# Altium schematic sheet Sheet2.SchDoc
size A4
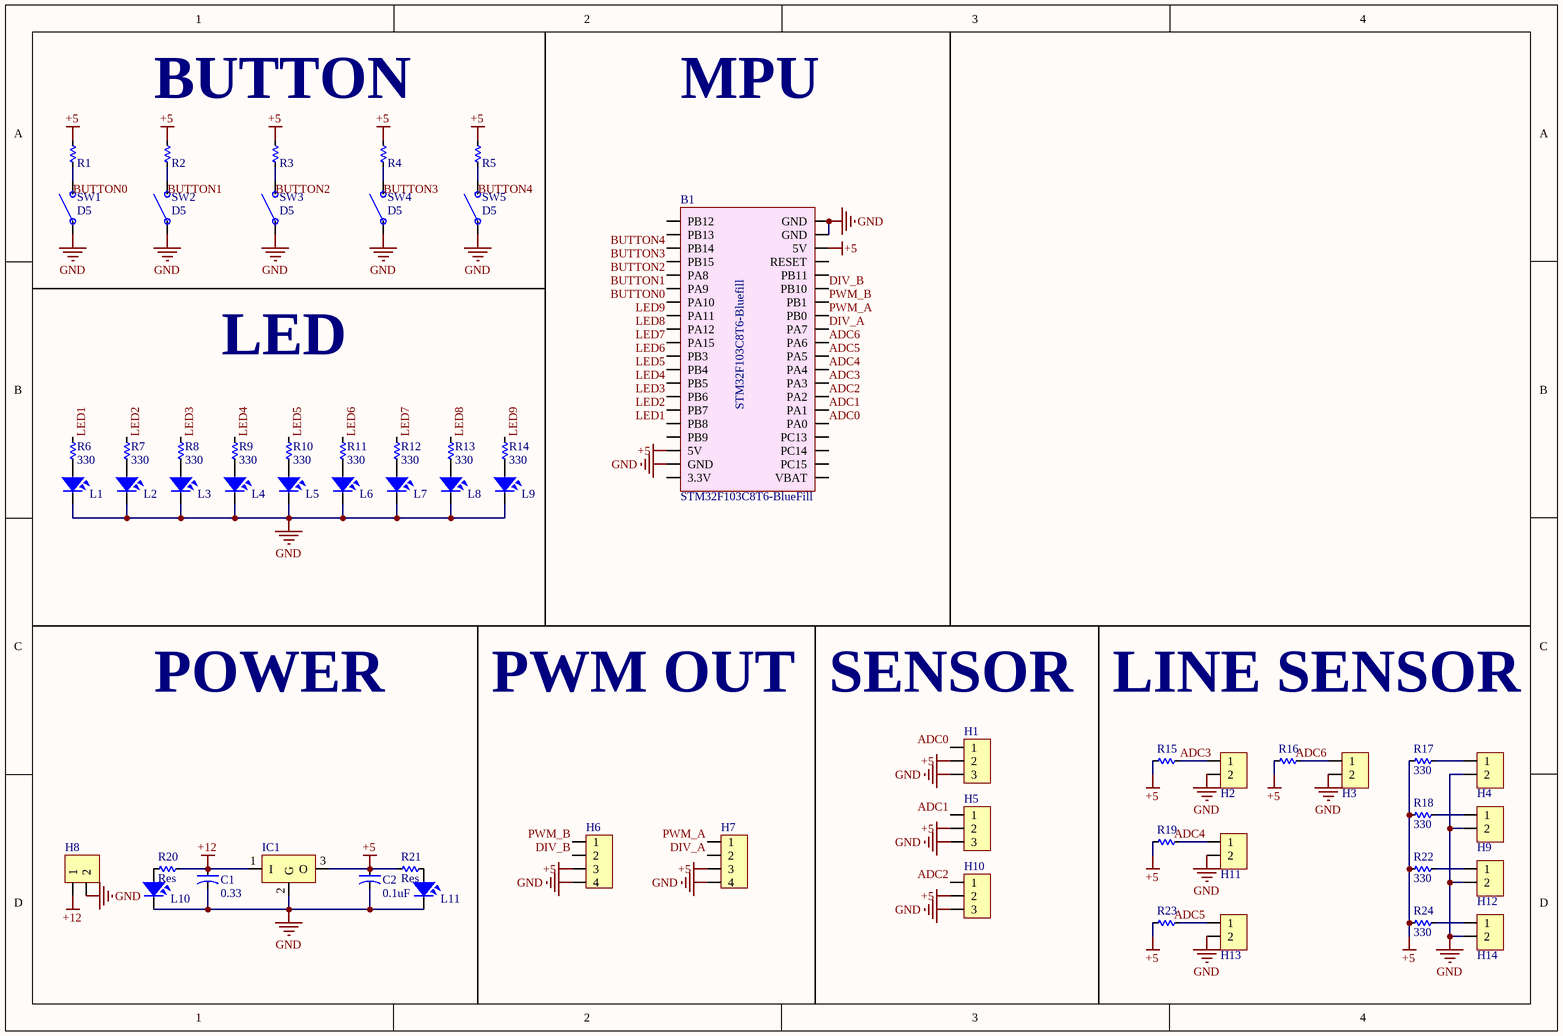
[diagram p0: Sheet2.SchDoc]

## Parts
B1  STM32F103C8T6-BlueFill  [STM32F1-Bluefill]
C1  0.33  [CA-ALU-2.54]
C2  0.1uF  [CA-ALU-2.54]
H1  Header3  [Header3]  (value not drawn)
H2  Header2  [HDR2]  (value not drawn)
H3  Header2  [HDR2]  (value not drawn)
H4  Header2  [HDR2]  (value not drawn)
H5  Header3  [Header3]  (value not drawn)
H6  Header4  [Header4]  (value not drawn)
H7  Header4  [Header4]  (value not drawn)
H8  Header2  [HDR2]  (value not drawn)
H9  Header2  [HDR2]  (value not drawn)
H10  Header3  [Header3]  (value not drawn)
H11  Header2  [HDR2]  (value not drawn)
H12  Header2  [HDR2]  (value not drawn)
H13  Header2  [HDR2]  (value not drawn)
H14  Header2  [HDR2]  (value not drawn)
IC1  LM78xx  [TO220-123]  (value not drawn)
L1  LED  [LED-3MM-YELLOW]  (value not drawn)
L2  LED  [LED-3MM-YELLOW]  (value not drawn)
L3  LED  [LED-3MM-YELLOW]  (value not drawn)
L4  LED  [LED-3MM-YELLOW]  (value not drawn)
L5  LED  [LED-3MM-YELLOW]  (value not drawn)
L6  LED  [LED-3MM-YELLOW]  (value not drawn)
L7  LED  [LED-3MM-YELLOW]  (value not drawn)
L8  LED  [LED-3MM-YELLOW]  (value not drawn)
L9  LED  [LED-3MM-YELLOW]  (value not drawn)
L10  LED  [LED-3MM-YELLOW]  (value not drawn)
L11  LED  [LED-3MM-YELLOW]  (value not drawn)
R1  10K  [RES-1/4WD]  (value not drawn)
R2  10K  [RES-1/4WD]  (value not drawn)
R3  10K  [RES-1/4WD]  (value not drawn)
R4  10K  [RES-1/4WD]  (value not drawn)
R5  10K  [RES-1/4WD]  (value not drawn)
R6  330  [RES-1/4W-SMALL]
R7  330  [RES-1/4W-SMALL]
R8  330  [RES-1/4W-SMALL]
R9  330  [RES-1/4W-SMALL]
R10  330  [RES-1/4W-SMALL]
R11  330  [RES-1/4W-SMALL]
R12  330  [RES-1/4W-SMALL]
R13  330  [RES-1/4W-SMALL]
R14  330  [RES-1/4W-SMALL]
R15  10K  [RES-1/4W-SMALL]  (value not drawn)
R16  10K  [RES-1/4W-SMALL]  (value not drawn)
R17  330  [RES-1/4W-SMALL]
R18  330  [RES-1/4W-SMALL]
R19  10K  [RES-1/4W-SMALL]  (value not drawn)
R20  Res  [RES-1/4W-SMALL]
R21  Res  [RES-1/4W-SMALL]
R22  330  [RES-1/4W-SMALL]
R23  10K  [RES-1/4W-SMALL]  (value not drawn)
R24  330  [RES-1/4W-SMALL]
SW1  D5  [D5]
SW2  D5  [D5]
SW3  D5  [D5]
SW4  D5  [D5]
SW5  D5  [D5]

## Nets
+5: B1.3(5V) B1.38(5V) C2.1 H1.2 H5.2 H6.3 H7.3 H10.2 IC1.3(O) R1.2 R2.2 R3.2 R4.2 R5.2 R15.1 R16.1 R17.1 R18.1 R19.1 R21.2 R22.1 R23.1 R24.1
+12: C1.1 H8.1 IC1.1(I) R20.1
GND: B1.2(GND) B1.39(GND) B1.40(GND) C1.2 C2.2 H1.3 H2.2 H3.2 H4.2 H5.3 H6.4 H7.4 H8.2 H9.2 H10.3 H11.2 H12.2 H13.2 H14.2 IC1.2(G) L1.2 L2.2 L3.2 L4.2 L5.2 L6.2 L7.2 L8.2 L9.2 L10.2 L11.2 SW1.1 SW2.1 SW3.1 SW4.1 SW5.1
ADC0: B1.25(PA0) H1.1
ADC1: B1.26(PA1) H5.1
ADC2: B1.27(PA2) H10.1
ADC3: B1.28(PA3) H2.1 R15.2
ADC4: B1.29(PA4) H11.1 R19.2
ADC5: B1.30(PA5) H13.1 R23.2
ADC6: B1.31(PA6) H3.1 R16.2
BUTTON0: B1.14(PA10) R1.1 SW1.2
BUTTON1: B1.15(PA9) R2.1 SW2.2
BUTTON2: B1.16(PA8) R3.1 SW3.2
BUTTON3: B1.17(PB15) R4.1 SW4.2
BUTTON4: B1.18(PB14) R5.1 SW5.2
DIV_A: B1.32(PA7) H7.2
DIV_B: B1.35(PB10) H6.2
LED1: B1.5(PB8) R6.1
LED2: B1.6(PB7) R7.1
LED3: B1.7(PB6) R8.1
LED4: B1.8(PB5) R9.1
LED5: B1.9(PB4) R10.1
LED6: B1.10(PB3) R11.1
LED7: B1.11(PA15) R12.1
LED8: B1.12(PA12) R13.1
LED9: B1.13(PA11) R14.1
PWM_A: B1.33(PB0) H7.1
PWM_B: B1.34(PB1) H6.1
NetH4_1: H4.1 R17.2
NetH9_1: H9.1 R18.2
NetH12_1: H12.1 R22.2
NetH14_1: H14.1 R24.2
NetL1_1: L1.1 R6.2
NetL2_1: L2.1 R7.2
NetL3_1: L3.1 R8.2
NetL4_1: L4.1 R9.2
NetL5_1: L5.1 R10.2
NetL6_1: L6.1 R11.2
NetL7_1: L7.1 R12.2
NetL8_1: L8.1 R13.2
NetL9_1: L9.1 R14.2
NetL10_1: L10.1 R20.2
NetL11_1: L11.1 R21.1

Not connected (* = marked no-connect by the designer): B1 1(3.3V) 4(PB9) 19(PB13) 20(PB12) 21(VBAT) 22(PC15) 23(PC14) 24(PC13) 36(PB11) 37(RESET)

## Notes on the sheet
- BUTTON
- MPU
- LED
- POWER
- PWM OUT
- (near H1) SENSOR
- LINE SENSOR
- Title
- Size:
- Date:
- A4
- Number:
- Time:
- Revision:
- Sheet
- of
- File:
- (in symbol STM32F103C8T6-BlueFill) STM32F103C8T6-Bluefill

## Library data of the parts
C1 C2 = CN-ALU-DIP: Capacitor (Semiconductor SIM Model); Value: 104; LatestRevisionDate: 17-Jul-2002; LatestRevisionNote: Re-released for DXP Platform.; PackageReference: C1206; Publisher: Altium Limited
H1 H5 H10 = Header3: Header IDC, 3 x 1 Pin Vertical 2.54mm Pitch (Non-Boxed, Male); Manufacturer: W¨¹rth Elektronik eiSos GmbH; partNo: 613002143121; ComponentLink1 Description: Manufacturer; ComponentLink2 Description: Datasheet; NoPins: 02; Created Date: 29 March 2013; ComponentLink1URL: http://www.we-online.com; ComponentLink2URL: http://katalog.we-online.de/em/datasheet/6130xx143121.pdf; Created by: Karrer Zheng
H2-H4 H8 H9 H11-H14 = Header2: Header IDC, 2 x 1 Pin Vertical 2.54mm Pitch (Non-Boxed, Male); Manufacturer: W¨¹rth Elektronik eiSos GmbH; partNo: 613002143121; ComponentLink1 Description: Manufacturer; ComponentLink2 Description: Datasheet; NoPins: 02; Created Date: 29 March 2013; ComponentLink1URL: http://www.we-online.com; ComponentLink2URL: http://katalog.we-online.de/em/datasheet/6130xx143121.pdf; Created by: Karrer Zheng
H6 H7 = Header4: Header IDC, 4 x 1 Pin Vertical 2.54mm Pitch (Non-Boxed, Male); Manufacturer: W¨¹rth Elektronik eiSos GmbH; partNo: 613002143121; ComponentLink1 Description: Manufacturer; ComponentLink2 Description: Datasheet; NoPins: 02; Created Date: 29 March 2013; ComponentLink1URL: http://www.we-online.com; ComponentLink2URL: http://katalog.we-online.de/em/datasheet/6130xx143121.pdf; Created by: Karrer Zheng
IC1 = LM78xx: Positive Voltage Regulator; Note: Tab is connected to pin 3 (GND).; Published: 24-Aug-2001; LatestRevisionDate: 17-Jul-2002; LatestRevisionNote: Re-released for DXP Platform.; DatasheetVersion: Apr-1994; PackageVersion: Jul-1998; PackageReference: ISOWATT220AB; Publisher: Altium Limited; PackageDescription: TO, Thru-Hole, Vertical, Heatsink Mounted; 3 In-Line Leads; Pitch 2.54 mm; Pin sequence 1, 3, 2; ComponentLink1Description: Manufacturer Link; ComponentLink1URL: http://www.st.com/; ComponentLink2Description: Datasheet; ComponentLink2URL: http://www.st.com/stonline/products/literature/ds/2146/l78m05c.pdf
L1-L11 = LED: LED Single colour Green and Red; Value: LED 3 ly Single Colour
R1-R24 = Res: Manufacturer: Generic Components; Class: Passive; SubClass: R; Published: 08/06/2000; Publisher: Altium Hobart Technology Centre